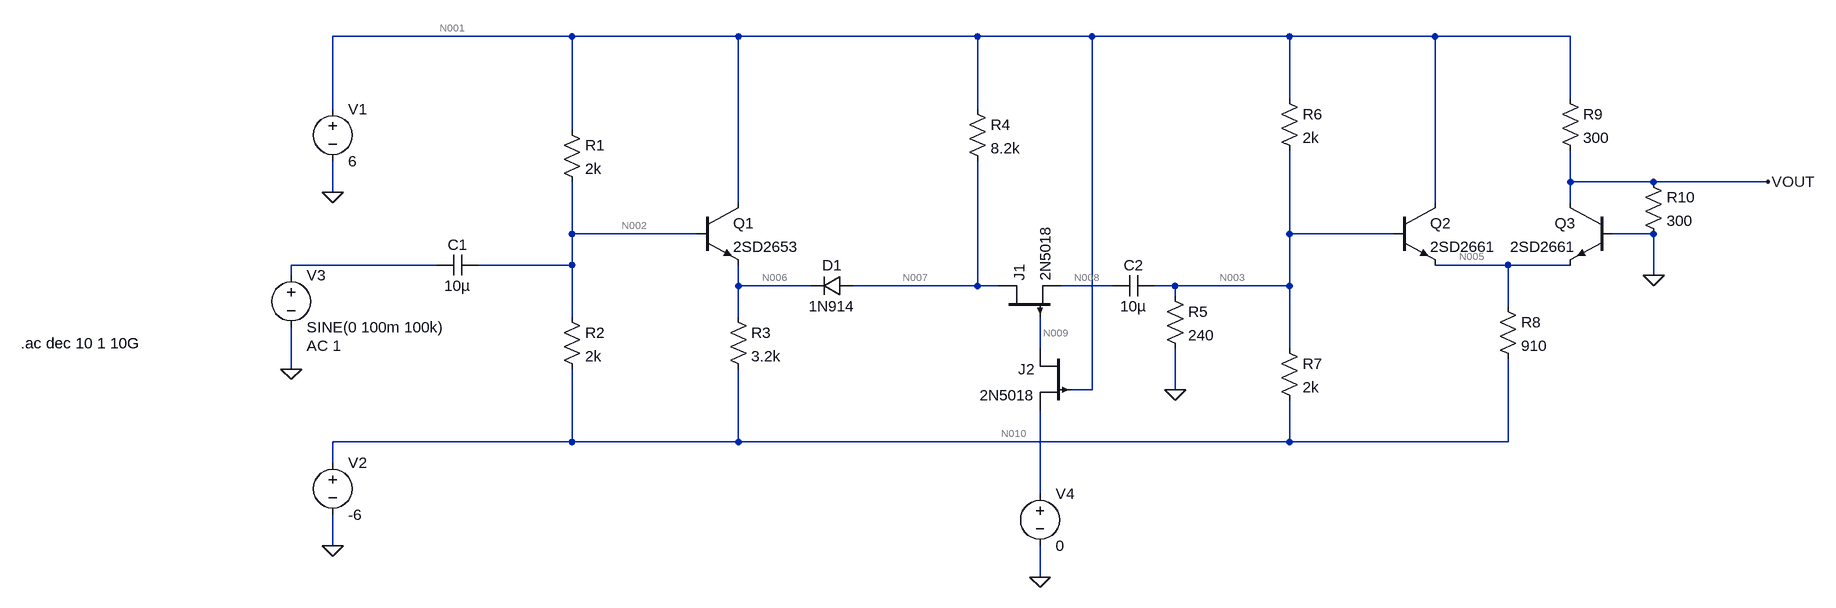
[diagram p0: schematic ACG1.asc]
ACG1.asc, the LTspice schematic file:
Version 4
SHEET 1 2264 868
WIRE 336 16 -32 16
WIRE 592 16 336 16
WIRE 960 16 592 16
WIRE 1136 16 960 16
WIRE 1440 16 1136 16
WIRE 1664 16 1440 16
WIRE 1872 16 1664 16
WIRE 1440 112 1440 16
WIRE 1872 112 1872 16
WIRE -32 128 -32 16
WIRE 960 128 960 16
WIRE 336 160 336 16
WIRE 1872 240 1872 192
WIRE 2000 240 1872 240
WIRE 2176 240 2000 240
WIRE -32 256 -32 208
WIRE 592 272 592 16
WIRE 1664 272 1664 16
WIRE 1872 272 1872 240
WIRE 336 320 336 240
WIRE 528 320 336 320
WIRE 1440 320 1440 192
WIRE 1600 320 1440 320
WIRE 2000 320 1936 320
WIRE 128 368 -96 368
WIRE 336 368 336 320
WIRE 336 368 192 368
WIRE 1776 368 1664 368
WIRE 1872 368 1776 368
WIRE -96 384 -96 368
WIRE 2000 384 2000 320
WIRE 592 400 592 368
WIRE 704 400 592 400
WIRE 960 400 960 208
WIRE 960 400 768 400
WIRE 992 400 960 400
WIRE 1168 400 1088 400
WIRE 1264 400 1232 400
WIRE 1440 400 1440 320
WIRE 1440 400 1264 400
WIRE 1264 416 1264 400
WIRE 1776 432 1776 368
WIRE 336 448 336 368
WIRE 592 448 592 400
WIRE 1056 496 1056 448
WIRE 1440 496 1440 400
WIRE -96 528 -96 464
WIRE 1136 560 1136 16
WIRE 1136 560 1104 560
WIRE 1264 560 1264 496
WIRE 336 640 336 528
WIRE 336 640 -32 640
WIRE 592 640 592 528
WIRE 592 640 336 640
WIRE 1440 640 1440 576
WIRE 1440 640 592 640
WIRE 1776 640 1776 512
WIRE 1776 640 1440 640
WIRE -32 672 -32 640
WIRE 1056 720 1056 592
WIRE -32 800 -32 752
WIRE 1056 848 1056 800
FLAG -32 256 0
FLAG -32 800 0
FLAG -96 528 0
FLAG 1056 848 0
FLAG 1264 560 0
FLAG 2000 384 0
FLAG 2176 240 VOUT
DATAFLAG 1360 400 ""
DATAFLAG 880 400 ""
DATAFLAG 2112 240 ""
DATAFLAG 1520 320 ""
SYMBOL voltage -32 112 R0
WINDOW 123 0 0 Left 0
WINDOW 39 0 0 Left 0
SYMATTR InstName V1
SYMATTR Value 6
SYMBOL voltage -32 656 R0
WINDOW 123 0 0 Left 0
WINDOW 39 0 0 Left 0
SYMATTR InstName V2
SYMATTR Value -6
SYMBOL cap 192 352 R90
WINDOW 0 0 32 VBottom 2
WINDOW 3 32 32 VTop 2
SYMATTR InstName C1
SYMATTR Value 10µ
SYMBOL res 320 144 R0
SYMATTR InstName R1
SYMATTR Value 2k
SYMBOL res 320 432 R0
SYMATTR InstName R2
SYMATTR Value 2k
SYMBOL npn 528 272 R0
SYMATTR InstName Q1
SYMATTR Value 2SD2653
SYMBOL voltage -96 368 R0
WINDOW 123 24 124 Left 2
WINDOW 39 0 0 Left 0
SYMATTR Value2 AC 1
SYMATTR InstName V3
SYMATTR Value SINE(0 100m 100k)
SYMBOL res 576 432 R0
SYMATTR InstName R3
SYMATTR Value 3.2k
SYMBOL diode 768 384 R90
WINDOW 0 0 32 VBottom 2
WINDOW 3 32 32 VTop 2
SYMATTR InstName D1
SYMATTR Value 1N914
SYMBOL res 944 112 R0
SYMATTR InstName R4
SYMATTR Value 8.2k
SYMBOL pjf 992 448 R270
SYMATTR InstName J1
SYMATTR Value 2N5018
SYMBOL pjf 1104 496 M0
SYMATTR InstName J2
SYMATTR Value 2N5018
SYMBOL voltage 1056 704 R0
WINDOW 123 0 0 Left 0
WINDOW 39 0 0 Left 0
SYMATTR InstName V4
SYMATTR Value 0
SYMBOL res 1248 400 R0
SYMATTR InstName R5
SYMATTR Value 240
SYMBOL res 1424 96 R0
SYMATTR InstName R6
SYMATTR Value 2k
SYMBOL res 1424 480 R0
SYMATTR InstName R7
SYMATTR Value 2k
SYMBOL npn 1600 272 R0
SYMATTR InstName Q2
SYMATTR Value 2SD2661
SYMBOL res 1760 416 R0
SYMATTR InstName R8
SYMATTR Value 910
SYMBOL res 1856 96 R0
SYMATTR InstName R9
SYMATTR Value 300
SYMBOL res 1984 224 R0
SYMATTR InstName R10
SYMATTR Value 300
SYMBOL npn 1936 272 M0
SYMATTR InstName Q3
SYMATTR Value 2SD2661
SYMBOL cap 1232 384 R90
WINDOW 0 0 32 VBottom 2
WINDOW 3 32 32 VTop 2
SYMATTR InstName C2
SYMATTR Value 10µ
TEXT -512 488 Left 2 !.ac dec 10 1 10G

The netlist it stands for:
* ACG1.asc
V1 N001 0 6
V2 N010 0 -6
C1 N002 N004 10µ
R1 N001 N002 2k
R2 N002 N010 2k
Q1 N001 N002 N006 0 2SD2653
V3 N004 0 SINE(0 100m 100k) AC 1
R3 N006 N010 3.2k
D1 N007 N006 1N914
R4 N001 N007 8.2k
J1 N007 N009 N008 2N5018
J2 N009 N001 N011 2N5018
V4 N011 0 0
R5 N003 0 240
R6 N001 N003 2k
R7 N003 N010 2k
Q2 N001 N003 N005 0 2SD2661
R8 N005 N010 910
R9 N001 VOUT 300
R10 VOUT 0 300
Q3 VOUT 0 N005 0 2SD2661
C2 N003 N008 10µ
.model D D
.lib standard.dio
.model NPN NPN
.model PNP PNP
.lib standard.bjt
.model NJF NJF
.model PJF PJF
.lib standard.jft
.ac dec 10 1 10G
.backanno
.end

* Results of the author's LTspice run, read from the files saved beside the schematic
* Operating Point, zero values left out:
*   V(n001) = 6 V
*   V(n010) = -6 V
*   V(n002) = -1.307 mV
*   V(n006) = -556 mV
*   V(n007) = 14.32 mV
*   V(n009) = 828.1 mV
*   V(n008) = 14.32 mV
*   V(n003) = -873.4 µV
*   V(n005) = -587.8 mV
*   V(vout) = 2.612 V
*   Ic(Q3) = 2.586 mA
*   Ib(Q3) = 4.673 µA
*   Ie(Q3) = -2.59 mA
*   Ic(Q2) = 3.353 mA
*   Ib(Q2) = 4.513 µA
*   Ie(Q2) = -3.357 mA
*   Ic(Q1) = 970 µA
*   Ib(Q1) = 1.307 µA
*   Ie(Q1) = -971.3 µA
*   I(D1) = 730 µA
*   Id(J2) = -12.95 pA
*   Ig(J2) = 26.99 pA
*   Is(J2) = -14.04 pA
*   Id(J1) = -12.95 pA
*   Ig(J1) = 12.95 pA
*   I(R10) = 8.707 mA
*   I(R9) = 11.29 mA
*   I(R8) = 5.948 mA
*   I(R7) = 3 mA
*   I(R6) = 3 mA
*   I(R5) = -3.639 µA
*   I(R4) = 730 µA
*   I(R3) = 1.701 mA
*   I(R2) = 2.999 mA
*   I(R1) = 3.001 mA
*   I(V4) = 14.04 pA
*   I(V2) = 13.65 mA
*   I(V1) = -22.35 mA
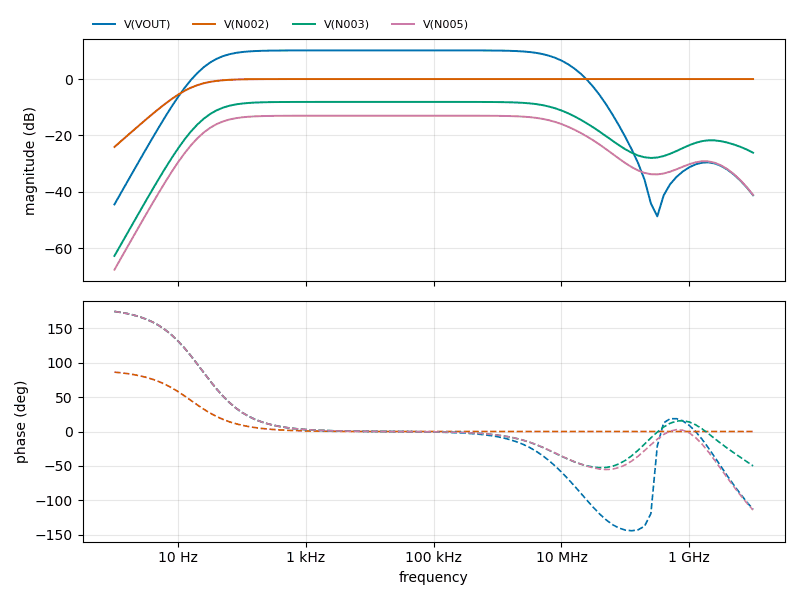
[diagram p1: AC Analysis of ACG1.asc, plotted from the saved traces]
* AC Analysis, 1 run:
*   V(VOUT): -44.42 dB at 1 Hz, -41.17 dB at 10 GHz, peak 10.15 dB at 15.85 kHz, 3 dB below the peak at 39.58 Hz and 8.71 MHz
*   V(N002): -24.06 dB at 1 Hz, -0.00 dB at 10 GHz, peak -0.00 dB at 10 GHz, 3 dB below the peak at 15.96 Hz
*   V(N003): -62.67 dB at 1 Hz, -26.11 dB at 10 GHz, peak -8.10 dB at 19.95 kHz, 3 dB below the peak at 39.58 Hz and 9.907 MHz
*   V(N005): -67.56 dB at 1 Hz, -41.05 dB at 10 GHz, peak -12.99 dB at 19.95 kHz, 3 dB below the peak at 39.58 Hz and 10.11 MHz